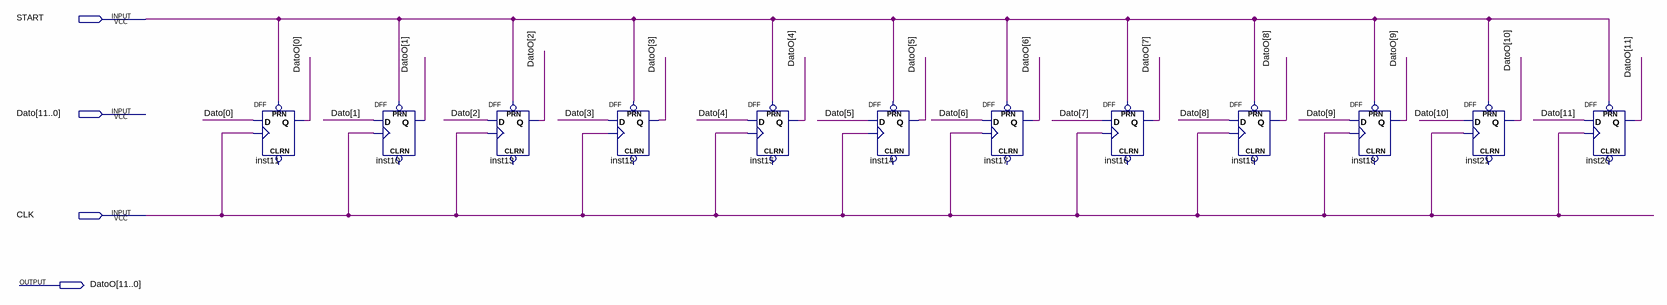
[diagram p0: schematic sheet]
// Quartus schematic Registro.bdf as structural Verilog: 12 symbols, 4 pins
module Registro (
  input  START,
  input  [11:0] Dato,
  input  CLK,
  output [11:0] DatoO
);

  DFF inst11 (.CLK(CLK), .D(Dato[0]), .PRN(START), .Q(DatoO[0]));  // open: CLRN
  DFF inst10 (.CLK(CLK), .D(Dato[1]), .PRN(START), .Q(DatoO[1]));  // open: CLRN
  DFF inst13 (.CLK(CLK), .D(Dato[2]), .PRN(START), .Q(DatoO[2]));  // open: CLRN
  DFF inst12 (.CLK(CLK), .D(Dato[3]), .PRN(START), .Q(DatoO[3]));  // open: CLRN
  DFF inst15 (.CLK(CLK), .D(Dato[4]), .PRN(START), .Q(DatoO[4]));  // open: CLRN
  DFF inst14 (.CLK(CLK), .D(Dato[5]), .PRN(START), .Q(DatoO[5]));  // open: CLRN
  DFF inst17 (.CLK(CLK), .D(Dato[6]), .PRN(START), .Q(DatoO[6]));  // open: CLRN
  DFF inst16 (.CLK(CLK), .D(Dato[7]), .PRN(START), .Q(DatoO[7]));  // open: CLRN
  DFF inst19 (.CLK(CLK), .D(Dato[8]), .PRN(START), .Q(DatoO[8]));  // open: CLRN
  DFF inst18 (.CLK(CLK), .D(Dato[9]), .PRN(START), .Q(DatoO[9]));  // open: CLRN
  DFF inst21 (.CLK(CLK), .D(Dato[10]), .PRN(START), .Q(DatoO[10]));  // open: CLRN
  DFF inst20 (.CLK(CLK), .D(Dato[11]), .PRN(START), .Q(DatoO[11]));  // open: CLRN
endmodule
